# EAGLE schematic BatteryMonitor (EAGLE 7.1.0)
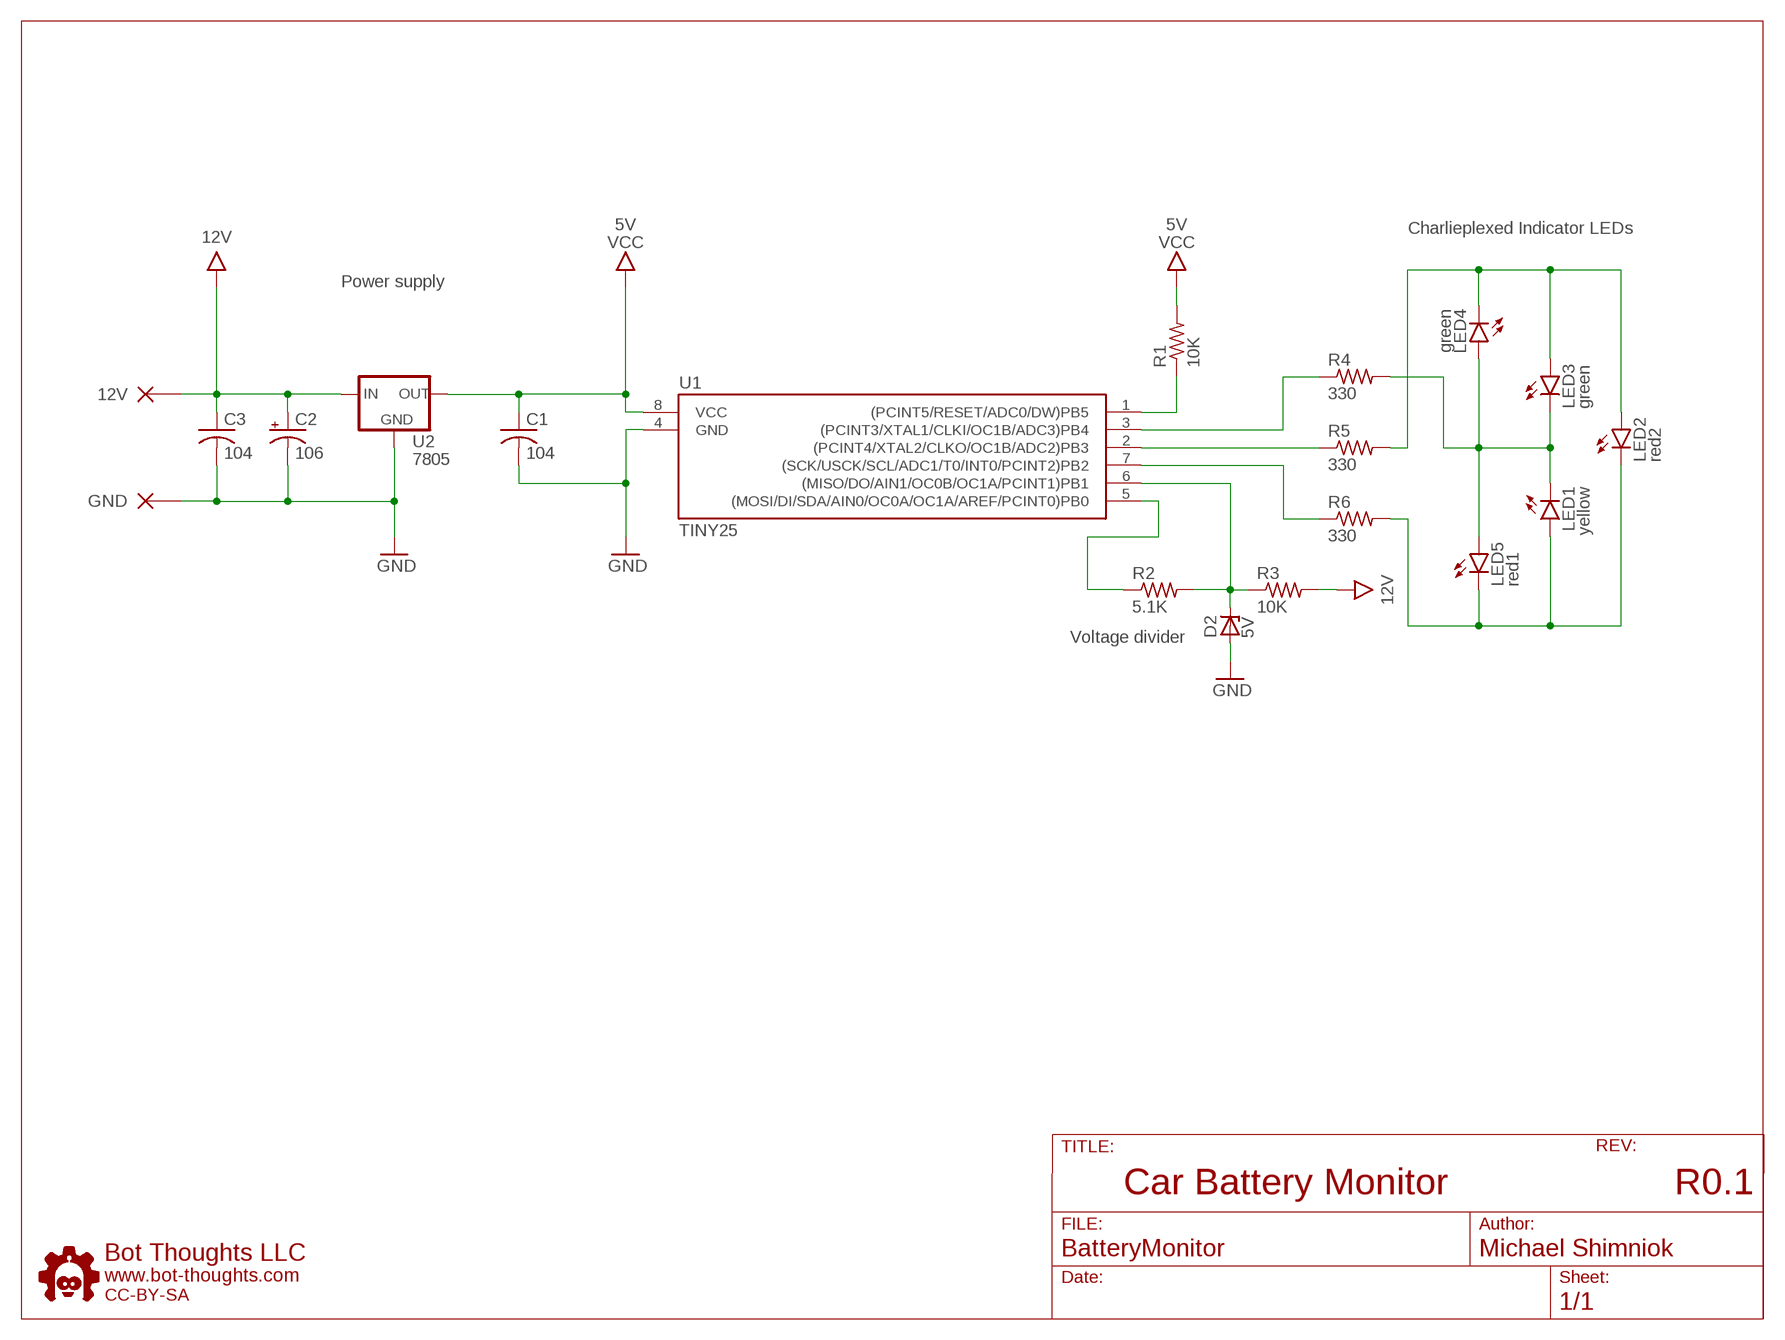
[diagram p0: schematic, sheet 1]

## Parts
C1  104  C-050PTH  [C050-024X044]
C2  106  CPOL-2.54-6MM  [E2,5-6]
C3  104  C-025PTH  [C025-024X044]
D2  5V  ZENER-DIODE-DO35  [DO35Z7]
LED1  yellow  LED5MMRA  [LED5MMRA]
LED2  red2  LED5MMRA  [LED5MMRA]
LED3  green  LED5MMRA  [LED5MMRA]
LED4  green  LED5MMRA  [LED5MMRA]
LED5  red1  LED5MMRA  [LED5MMRA]
R1  10K  R0204/5-PTH  [0204/5]
R2  5.1K  R0204/5-PTH  [0204/5]
R3  10K  R0204/5-PTH  [0204/5]
R4  330  R0204/5-PTH  [0204/5]
R5  330  R0204/5-PTH  [0204/5]
R6  330  R0204/5-PTH  [0204/5]
U1  TINY25  ATTINY45/85-MU  [DIL08]
U2  7805  78XX-TO220H-NH  [TO220BH-NH]
U$5  BTLOGO-LOGO-MD  [BTLOGOM]
X1  12V  WIREPAD_18GA  [PAD_18GA]
X2  GND  WIREPAD_18GA  [PAD_18GA]

## Nets
12V: C2.+ C3.1(+) R3.2 U2.1(IN) X1.P$1(P)
GND: C1.2(-) C2.- C3.2(-) D2.A U1.4(GND) U2.2(GND) X2.P$1(P)
N$1: R1.1 U1.1((PCINT5/RESET/ADC0/DW)PB5)
N$2: LED2.A LED3.A LED4.C R5.2
N$3: LED1.C LED3.C LED4.A LED5.A R4.2
N$4: R4.1 U1.3((PCINT3/XTAL1/CLKI/OC1B/ADC3)PB4)
N$5: LED1.A LED2.C LED5.C R6.2
N$6: R5.1 U1.2((PCINT4/XTAL2/CLKO/OC1B/ADC2)PB3)
N$7: R6.1 U1.7((SCK/USCK/SCL/ADC1/T0/INT0/PCINT2)PB2)
N$9: R2.1 U1.5((MOSI/DI/SDA/AIN0/OC0A/OC1A/AREF/PCINT0)PB0)
VCC: C1.1(+) R1.2 U1.8(VCC) U2.3(OUT) ; supply symbol labelled 5V
VTEST: D2.C R2.2 R3.1 U1.6((MISO/DO/AIN1/OC0B/OC1A/PCINT1)PB1)

## Notes on the sheet
- Charlieplexed Indicator LEDs
- Power supply
- Voltage divider
- Car Battery Monitor | R0.1

## Library data of the parts
C1 C3 = bt_rcl:C: Capacitor, non-polarized, American symbol
C2 = bt_rcl:CPOL: Capacitor, Polarized, American symbol
D2 = bt_diode:ZENER-DIODE: Generic Zener diode
LED1-LED5 = bt_opto:LED: LED Various packages
R1-R6 = bt_rcl:R: Resistor, American symbol
U1 = bt_avr:ATTINY45/85
U2 = bt_regulator:78XX: 78XX Linear Voltage Regulator The venerable 7800-series Linear Voltage Regulator, including 7805, 7809, 7812, 7815, 7862 in 5 V, 6.2 V, 8.2 V, 9 V, 12 V, and 15 V, respectively Datasheets TI_LM78L05.pdf <http://www.ti.com/lit/ds/symlink/lm78l05.pdf> Fairchild_LM7805.pdf <https://www.fairchildsemi.com/datasheets/LM/LM7805.pdf>
U$5 = bt:BTLOGO: Bot Thoughts Logo
X1 X2 = bt_electromech:WIREPAD: PIN PAD (PINPAD) Generic pin pad connector